# EAGLE design ep2c5_06(DRAM+SD) (EAGLE 7.2.0)
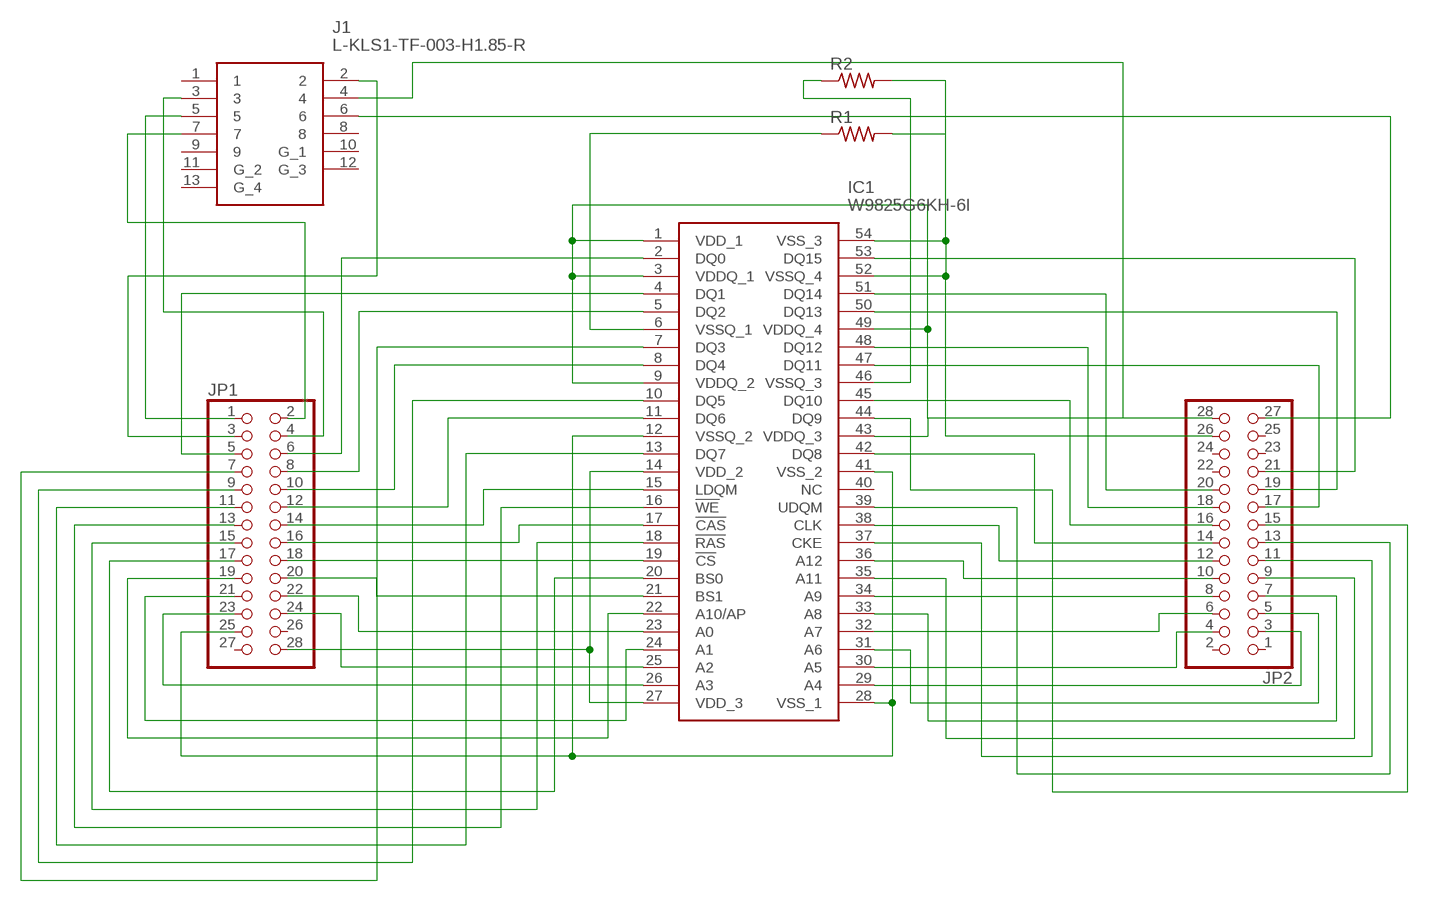
[diagram p0: schematic, sheet 1]

## Parts
IC1  W9825G6KH-6I  [SOP80P1176X120-54N]
J1  L-KLS1-TF-003-H1.85-R  [L-KLS1-TF-003-H1.85-R]
JP1  PINHD-2X14  [2X14]
JP2  PINHD-2X14  [2X14]
R1  R-US_R0805  [R0805]
R2  R-US_R0805  [R0805]

## Nets
N$1: IC1.14(VDD_2) IC1.27(VDD_3) JP1.28
N$2: IC1.12(VSSQ_2) IC1.28(VSS_1) IC1.41(VSS_2) JP1.25
N$3: IC1.1(VDD_1) IC1.3(VDDQ_1) IC1.9(VDDQ_2) IC1.43(VDDQ_3) IC1.49(VDDQ_4) J1.4 JP2.28
N$4: IC1.52(VSSQ_4) IC1.54(VSS_3) JP2.26 R1.2 R2.2
N$5: IC1.6(VSSQ_1) R1.1
N$6: IC1.46(VSSQ_3) R2.1
N$7: IC1.26(A3) JP1.23
N$8: IC1.25(A2) JP1.24
N$9: IC1.24(A1) JP1.21
N$10: IC1.23(A0) JP1.22
N$11: IC1.22(A10/AP) JP1.19
N$12: IC1.21(BS1) JP1.20
N$13: IC1.20(BS0) JP1.17
N$14: IC1.19(!CS) JP1.18
N$15: IC1.18(!RAS) JP1.15
N$16: IC1.17(!CAS) JP1.16
N$17: IC1.16(!WE) JP1.13
N$18: IC1.15(LDQM) JP1.14
N$19: IC1.13(DQ7) JP1.11
N$20: IC1.11(DQ6) JP1.12
N$21: IC1.10(DQ5) JP1.9
N$22: IC1.8(DQ4) JP1.10
N$23: IC1.7(DQ3) JP1.7
N$24: IC1.5(DQ2) JP1.8
N$25: IC1.4(DQ1) JP1.5
N$26: IC1.2(DQ0) JP1.6
N$27: IC1.29(A4) JP2.3
N$28: IC1.30(A5) JP2.4
N$29: IC1.31(A6) JP2.5
N$30: IC1.32(A7) JP2.6
N$31: IC1.33(A8) JP2.7
N$32: IC1.34(A9) JP2.8
N$33: IC1.35(A11) JP2.9
N$34: IC1.36(A12) JP2.10
N$35: IC1.37(CKE) JP2.11
N$36: IC1.38(CLK) JP2.12
N$37: IC1.39(UDQM) JP2.13
N$38: IC1.42(DQ8) JP2.14
N$39: IC1.44(DQ9) JP2.15
N$40: IC1.45(DQ10) JP2.16
N$41: IC1.47(DQ11) JP2.17
N$42: IC1.48(DQ12) JP2.18
N$43: IC1.50(DQ13) JP2.19
N$44: IC1.51(DQ14) JP2.20
N$45: IC1.53(DQ15) JP2.21
N$46: J1.6 JP2.27
N$47: J1.2 JP1.3
N$48: J1.3 JP1.4
N$49: J1.5 JP1.1
N$50: J1.7 JP1.2
Unconnected: IC1.40(NC) J1.1 J1.8 J1.9 J1.10(G_1) J1.11(G_2) J1.12(G_3) J1.13(G_4) JP1.26 JP1.27 JP2.1 JP2.2 JP2.22 JP2.23 JP2.24 JP2.25

## Library data of the parts
IC1 = W9825G6KH-6I:W9825G6KH-6I: Winbond W9825G6KH-6I, SDRAM 256Mbit Surface Mount, 166MHz, 54-Pin TSOP Source: Datasheet <http://www.winbond.com/resource-files/w9825g6kh_a04.pdf>; DESCRIPTION: Winbond W9825G6KH-6I, SDRAM 256Mbit Surface Mount, 166MHz, 54-Pin TSOP; HEIGHT: 1.2mm; MANUFACTURER_NAME: Winbond; MANUFACTURER_PART_NUMBER: W9825G6KH-6I; MOUSER_PART_NUMBER: 454-W9825G6KH-6I; MOUSER_PRICE-STOCK: https://www.mouser.com/Search/Refine.aspx?Keyword=454-W9825G6KH-6I; RS_PART_NUMBER: 1882632; RS_PRICE-STOCK: http://uk.rs-online.com/web/p/products/1882632
J1 = L-KLS1-TF-003-H1.85-R:L-KLS1-TF-003-H1.85-R: Micro SD Card Connector Source: Datasheet <https://img.ozdisan.com/ETicaret_Dosya/476392_7149645.pdf>; DESCRIPTION: Micro SD Card Connector; HEIGHT: mm; MANUFACTURER_NAME: KLS Electronic; MANUFACTURER_PART_NUMBER: L-KLS1-TF-003-H1.85-R
JP1 JP2 = pinhead:PINHD-2X14: PIN HEADER
R1 R2 = adafruit:R-US_: RESISTOR, American symbol

## Net classes
0 default: width 0.35 mm

## Board
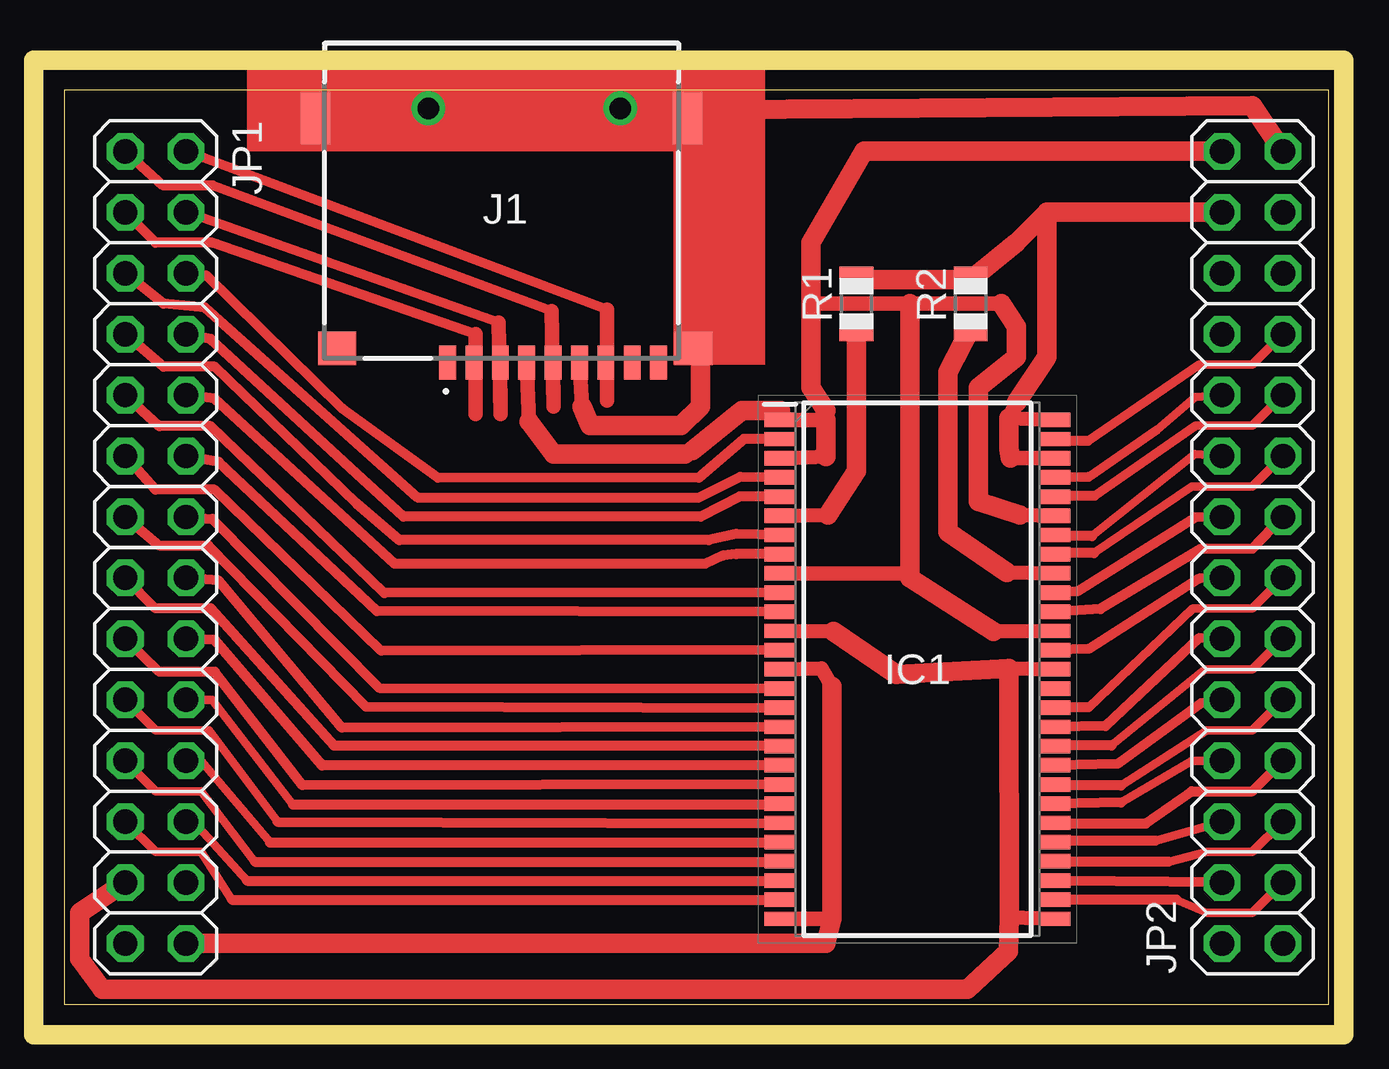
[diagram p1: board, top side]

Size 52.7 x 38.1 mm. Coordinates in mm from the lower left corner, seen from the top.
Outline: 0,0 52.7,0 52.7,38.1 0,38.1 0,0
Copper layers (1*16): Top 0.035mm / dielectric 1.5mm / Bottom 0.035mm
Design rules "default": minimum track width 10mil, minimum drill 24mil, track to track 8mil, track to pad 8mil, pad to pad 8mil, via to via 8mil, smd to smd 8mil, copper to edge 40mil, drill to drill 8mil, minimum pad ring 10mil, minimum via ring 8mil, stop-mask expansion 4mil, vias tented up to drill 0mil, thermal gap 10mil
Milling: 4 lines

### Footprints (pad centres in the part's own frame; a part is rotated, then mirrored left to right if it is on the bottom)
SOP80P1176X120-54N = smd 1.295 x 0.6: 1 -5.728,10.4; 2 -5.728,9.6; 3 -5.728,8.8; 4 -5.728,8; 5 -5.728,7.2; 6 -5.728,6.4; 7 -5.728,5.6; 8 -5.728,4.8; 9 -5.728,4; 10 -5.728,3.2; 11 -5.728,2.4; 12 -5.728,1.6; 13 -5.728,0.8; 14 -5.728,0; 15 -5.728,-0.8; 16 -5.728,-1.6; 17 -5.728,-2.4; 18 -5.728,-3.2; 19 -5.728,-4; 20 -5.728,-4.8; 21 -5.728,-5.6; 22 -5.728,-6.4; 23 -5.728,-7.2; 24 -5.728,-8; 25 -5.728,-8.8; 26 -5.728,-9.6; 27 -5.728,-10.4; 28 5.728,-10.4; 29 5.728,-9.6; 30 5.728,-8.8; 31 5.728,-8; 32 5.728,-7.2; 33 5.728,-6.4; 34 5.728,-5.6; 35 5.728,-4.8; 36 5.728,-4; 37 5.728,-3.2; 38 5.728,-2.4; 39 5.728,-1.6; 40 5.728,-0.8; 41 5.728,0; 42 5.728,0.8; 43 5.728,1.6; 44 5.728,2.4; 45 5.728,3.2; 46 5.728,4; 47 5.728,4.8; 48 5.728,5.6; 49 5.728,6.4; 50 5.728,7.2; 51 5.728,8; 52 5.728,8.8; 53 5.728,9.6; 54 5.728,10.4
L-KLS1-TF-003-H1.85-R = smd 0.7 x 1.4: 1 2.25,10.6; 2 1.15,10.6; 3 0.05,10.6; 4 -1.05,10.6; 5 -2.15,10.6; 6 -3.25,10.6; 7 -4.35,10.6; 8 -5.45,10.6; 9 -6.55,10.6 | smd 1.6 x 1.4: 10 -8,10; 13 6.85,10 | smd 1.2 x 2.2: 11 -7.75,0.4; 12 7.75,0.4 | drill 0.9 pad 1.4: 14 3.05,0; 15 -4.95,0
2X14 = drill 1.016 octagon: 1 -16.51,-1.27; 2 -16.51,1.27; 3 -13.97,-1.27; 4 -13.97,1.27; 5 -11.43,-1.27; 6 -11.43,1.27; 7 -8.89,-1.27; 8 -8.89,1.27; 9 -6.35,-1.27; 10 -6.35,1.27; 11 -3.81,-1.27; 12 -3.81,1.27; 13 -1.27,-1.27; 14 -1.27,1.27; 15 1.27,-1.27; 16 1.27,1.27; 17 3.81,-1.27; 18 3.81,1.27; 19 6.35,-1.27; 20 6.35,1.27; 21 8.89,-1.27; 22 8.89,1.27; 23 11.43,-1.27; 24 11.43,1.27; 25 13.97,-1.27; 26 13.97,1.27; 27 16.51,-1.27; 28 16.51,1.27
R0805 = smd 1.1 x 1.4: 1 -1,0; 2 1,0

### Placement (x,y rotation side)
IC1  35.56,13.97 0 top
J1  18.22,37.36 180 top
JP1  3.81,19.05 270 top
JP2  49.53,19.05 90 top
R1  33.02,29.21 90 top
R2  37.78,29.21 90 top

### Tracks (layer width: path | path; a pad name or v marks a point on that pad's centre or on a via)
N$1
  Top 0.61: IC1.27 32,3.58 | IC1.14 31.56,14 32,13.25
  Top 0.813: JP1.28 31.75,2.54 32,3.58 32,13.25
N$2
  Top 0.61: 39.37,14.01 IC1.41 | IC1.28 39.4,3.64 | IC1.12 32.07,15.56
  Top 0.813: JP1.25 0.64,3.81 0.64,1.91 1.59,0.64 37.64,0.62 39.36,2.22 39.4,3.64 39.37,14.01 34.69,13.76 32.07,15.56
N$3
  Top 0.406: 31.75,24.77 31.75,24.36 | 30.48,22.78 IC1.3 | 35.24,17.97 35.24,17.78
  Top 0.61: IC1.43 38.73,15.56 | 31.75,22.84 30.48,22.78 | 31.75,24.36 IC1.1 29.84,24.38 29.84,24.77 | 31.11,29.21 35.24,29.21 39.05,29.21 | IC1.49 39.84,20.4 | IC1.9 35.24,17.97 | J1.4 19.37,24.29 | 26.19,23.1 25.88,22.94
  Top 0.813: 38.73,15.56 35.24,17.78 | JP2.28 33.34,35.56 31.11,31.75 31.11,29.21 31.11,25.72 31.75,24.77 | 31.75,24.36 31.75,22.84 | 35.24,17.97 35.24,29.21 | 39.84,20.4 38.1,20.95 38.1,25.72 39.69,26.99 39.69,28.26 39.05,29.21 | 19.37,24.29 20.4,22.94 25.88,22.94 | 29.84,24.77 28.26,24.77 26.19,23.1
N$4
  Top 0.61: IC1.52 39.43,22.78 | 39.69,25.08 39.37,24.45 IC1.54
  Top 0.813: JP2.26 40.96,33.02 | 40.96,33.02 39.69,31.75 R2.2 R1.2 | 39.43,22.78 39.37,23.18 39.37,24.45 | 39.69,25.08 40.96,26.99 40.96,33.02
N$5
  Top 0.61: 31.83,20.4 IC1.6
  Top 0.813: R1.1 33.02,22.23 31.83,20.4
N$6
  Top 0.61: 39.3,18.02 IC1.46
  Top 0.813: 39.3,18.02 36.83,19.68 36.83,26.35 R2.1
N$7
  Top 0.35: 6.99,4.37 5.71,6.35 3.81,6.35 JP1.23 | 29.53,4.37 IC1.26
  Top 0.406: 6.99,4.37 29.53,4.37
N$8
  Top 0.35: 7.62,5.16 5.4,7.62 JP1.24 | 29.53,5.16 IC1.25
  Top 0.406: 7.62,5.16 29.53,5.16
N$9
  Top 0.35: 7.94,5.95 5.71,8.89 3.81,8.89 JP1.21 | 29.53,5.95 IC1.24
  Top 0.406: 7.94,5.95 29.53,5.95
N$10
  Top 0.35: 8.57,6.75 5.71,10.16 JP1.22 | 29.45,6.75 IC1.23
  Top 0.406: 8.57,6.75 29.45,6.75
N$11
  Top 0.35: 8.89,7.62 6.03,11.43 3.81,11.43 JP1.19 | 29.45,7.54 IC1.22
  Top 0.406: 8.89,7.62 29.45,7.54
N$12
  Top 0.35: 9.53,8.33 6.17,12.7 JP1.20 | 29.53,8.33 IC1.21
  Top 0.406: 9.53,8.33 29.53,8.33
N$13
  Top 0.406: IC1.20 9.93,9.13 6.27,13.87 3.96,13.87 JP1.17
N$14
  Top 0.406: IC1.19 10.74,9.96 6.27,15.19 JP1.18
N$15
  Top 0.406: IC1.18 11.24,10.78 6.11,16.51 3.8,16.51 JP1.15
N$16
  Top 0.406: IC1.17 11.58,11.53 6.44,17.67 JP1.16
N$17
  Top 0.406: JP1.13 3.95,19.13 6.01,19.13 12.57,12.41 IC1.16
N$18
  Top 0.406: JP1.14 6.17,20.24 13.12,13.2 IC1.15
N$19
  Top 0.406: IC1.13 13.21,14.74 6.26,21.46 3.8,21.46 JP1.11
N$20
  Top 0.406: IC1.11 13.04,16.4 6.44,22.62 JP1.12
N$21
  Top 0.406: IC1.10 13.34,17.14 6.11,24.11 3.96,24.11 JP1.9
N$22
  Top 0.406: JP1.10 6.27,25.26 13.79,18.36 26.71,18.36 27.45,18.71 28.01,18.77 IC1.8
N$23
  Top 0.406: JP1.7 4.13,26.58 6.27,26.58 12.2,20.88 13.96,19.36 26.86,19.36 28,19.61 IC1.7
N$24
  Top 0.406: JP1.8 6.11,27.74 12.18,22.13 14.14,20.33 26.53,20.33 28.16,21.18 IC1.5
N$25
  Top 0.406: IC1.4 28.18,21.99 26.43,21.11 14.76,21.11 5.87,29.05 4.13,29.21 JP1.5
N$26
  Top 0.406: JP1.6 5.94,30.38 11.59,24.84 15.57,21.96 26.44,21.95 28.32,23.57 IC1.2
N$27
  Top 0.35: 46.35,4.37 47.62,3.81 49.53,3.81 JP2.3 | 41.59,4.37 IC1.29
  Top 0.406: 46.35,4.37 41.59,4.37
N$28
  Top 0.35: 41.59,5.16 IC1.30
  Top 0.406: JP2.4 41.59,5.16
N$29
  Top 0.35: 46.04,5.95 47.62,6.35 49.53,6.35 JP2.5 | 41.59,5.95 IC1.31
  Top 0.406: 46.04,5.95 41.59,5.95
N$30
  Top 0.35: JP2.6 45.48,6.83 | 41.67,6.83 IC1.32
  Top 0.406: 45.48,6.83 41.67,6.83
N$31
  Top 0.406: IC1.33 41.34,7.54 45.09,7.54 46.99,8.89 49.53,8.89 JP2.7
N$32
  Top 0.35: 44.05,8.41 46.99,10.16 JP2.8
  Top 0.406: 44.05,8.41 IC1.34
N$33
  Top 0.35: 44.05,9.13 47.62,11.43 49.53,11.43 JP2.9 | 41.51,9.13 IC1.35
  Top 0.406: 44.05,9.13 41.51,9.13
N$34
  Top 0.406: JP2.10 47.38,12.55 43.91,10.04 IC1.36
N$35
  Top 0.35: 43.65,10.79 47.54,13.97 49.53,13.97 JP2.11 | 41.59,10.79 IC1.37
  Top 0.406: 43.65,10.79 41.59,10.79
N$36
  Top 0.406: JP2.12 47.3,15.27 43.41,11.61 IC1.38
N$37
  Top 0.35: 42.7,12.38 47.05,16.51 49.53,16.51 JP2.13 | 41.59,12.38 IC1.39
  Top 0.406: 42.7,12.38 41.59,12.38
N$38
  Top 0.406: JP2.14 47.3,17.75 42.7,14.83 IC1.42
N$39
  Top 0.406: JP2.15 49.53,18.99 47.38,18.99 43.19,16.48 IC1.44
N$40
  Top 0.406: JP2.16 47.14,20.31 42.23,17.22 IC1.45
N$41
  Top 0.35: 42.92,18.81 46.99,21.59 49.53,21.59 JP2.17 | 41.59,18.81 IC1.47
  Top 0.406: 42.92,18.81 41.59,18.81
N$42
  Top 0.35: 42.84,19.53 47.13,22.94 JP2.18 | 41.59,19.53 IC1.48
  Top 0.406: 42.84,19.53 41.59,19.53
N$43
  Top 0.35: 42.95,21.19 47.17,24.13 49.53,24.13 JP2.19 | 41.59,21.19 IC1.50
  Top 0.406: 42.95,21.19 41.59,21.19
N$44
  Top 0.35: 42.7,21.99 45.57,23.97 47.16,25.32 JP2.20
  Top 0.406: 42.7,21.99 IC1.51
N$45
  Top 0.35: 42.67,23.5 47.31,26.67 49.53,26.67 JP2.21 | 41.59,23.5 IC1.53
  Top 0.406: 42.67,23.5 41.59,23.5
N$46
  Top 0.61: J1.6 21.59,24.92
  Top 0.813: 21.59,24.92 21.91,24.13 25.72,24.13 26.51,24.92 26.51,35.4 27.3,37.31 49.53,37.47 JP2.27
N$47
  Top 0.406: J1.2 17.14,24.61 | 17.14,27.94 6.19,31.75 3.81,31.75 JP1.3
  Top 0.61: 17.14,24.61 17.14,27.94
N$48
  Top 0.406: 18.1,28.42 JP1.4
  Top 0.61: J1.3 18.18,24.61 18.1,28.42
N$49
  Top 0.406: 20.32,28.89 6.19,34.13 4.13,34.13 JP1.1
  Top 0.61: J1.5 20.4,24.92 20.32,28.89
N$50
  Top 0.406: J1.7 22.62,25.16 | 22.62,28.97 JP1.2
  Top 0.61: 22.62,25.16 22.62,28.97
(copper drawn outside any net)
  shapes: Top area x2